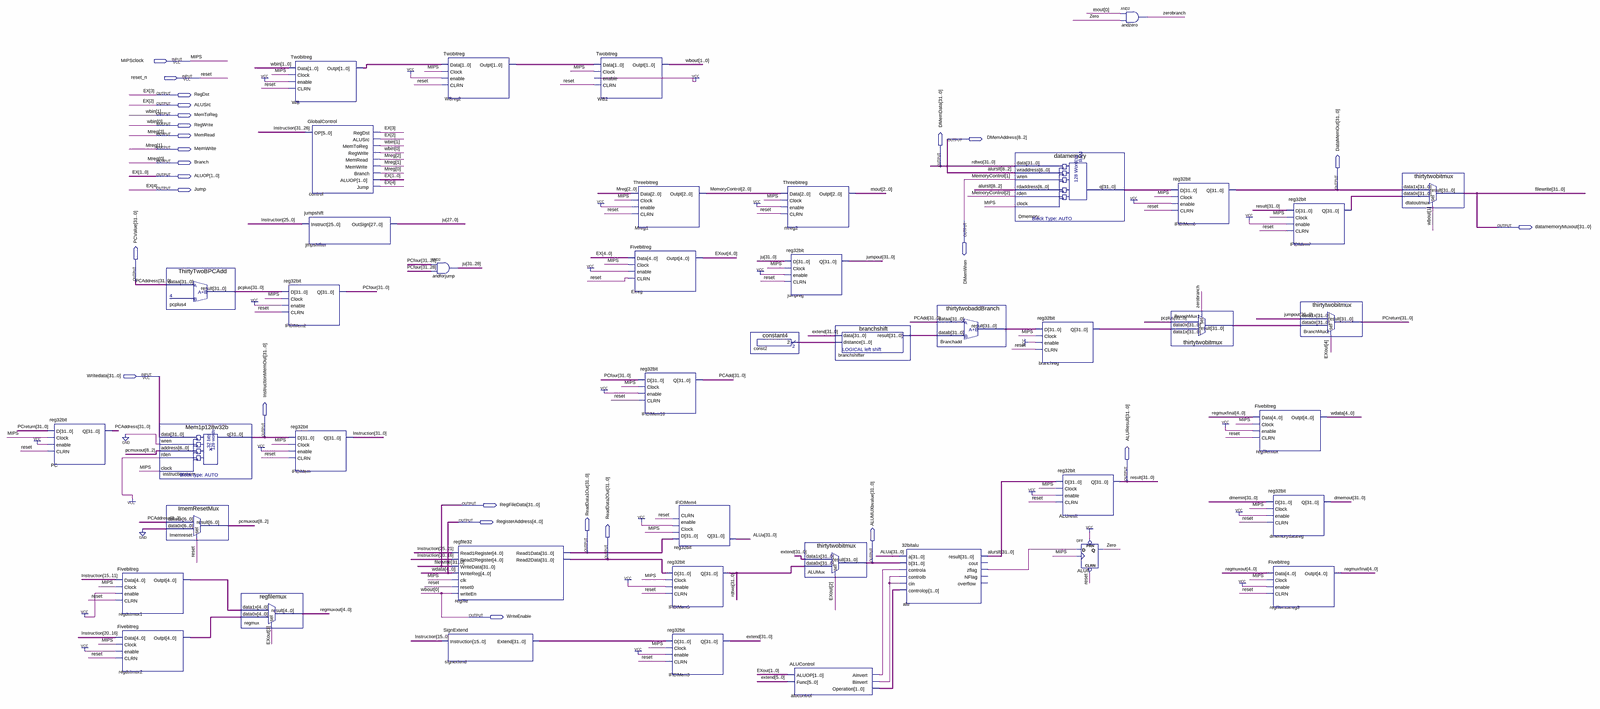
[diagram p0: schematic sheet, whole]
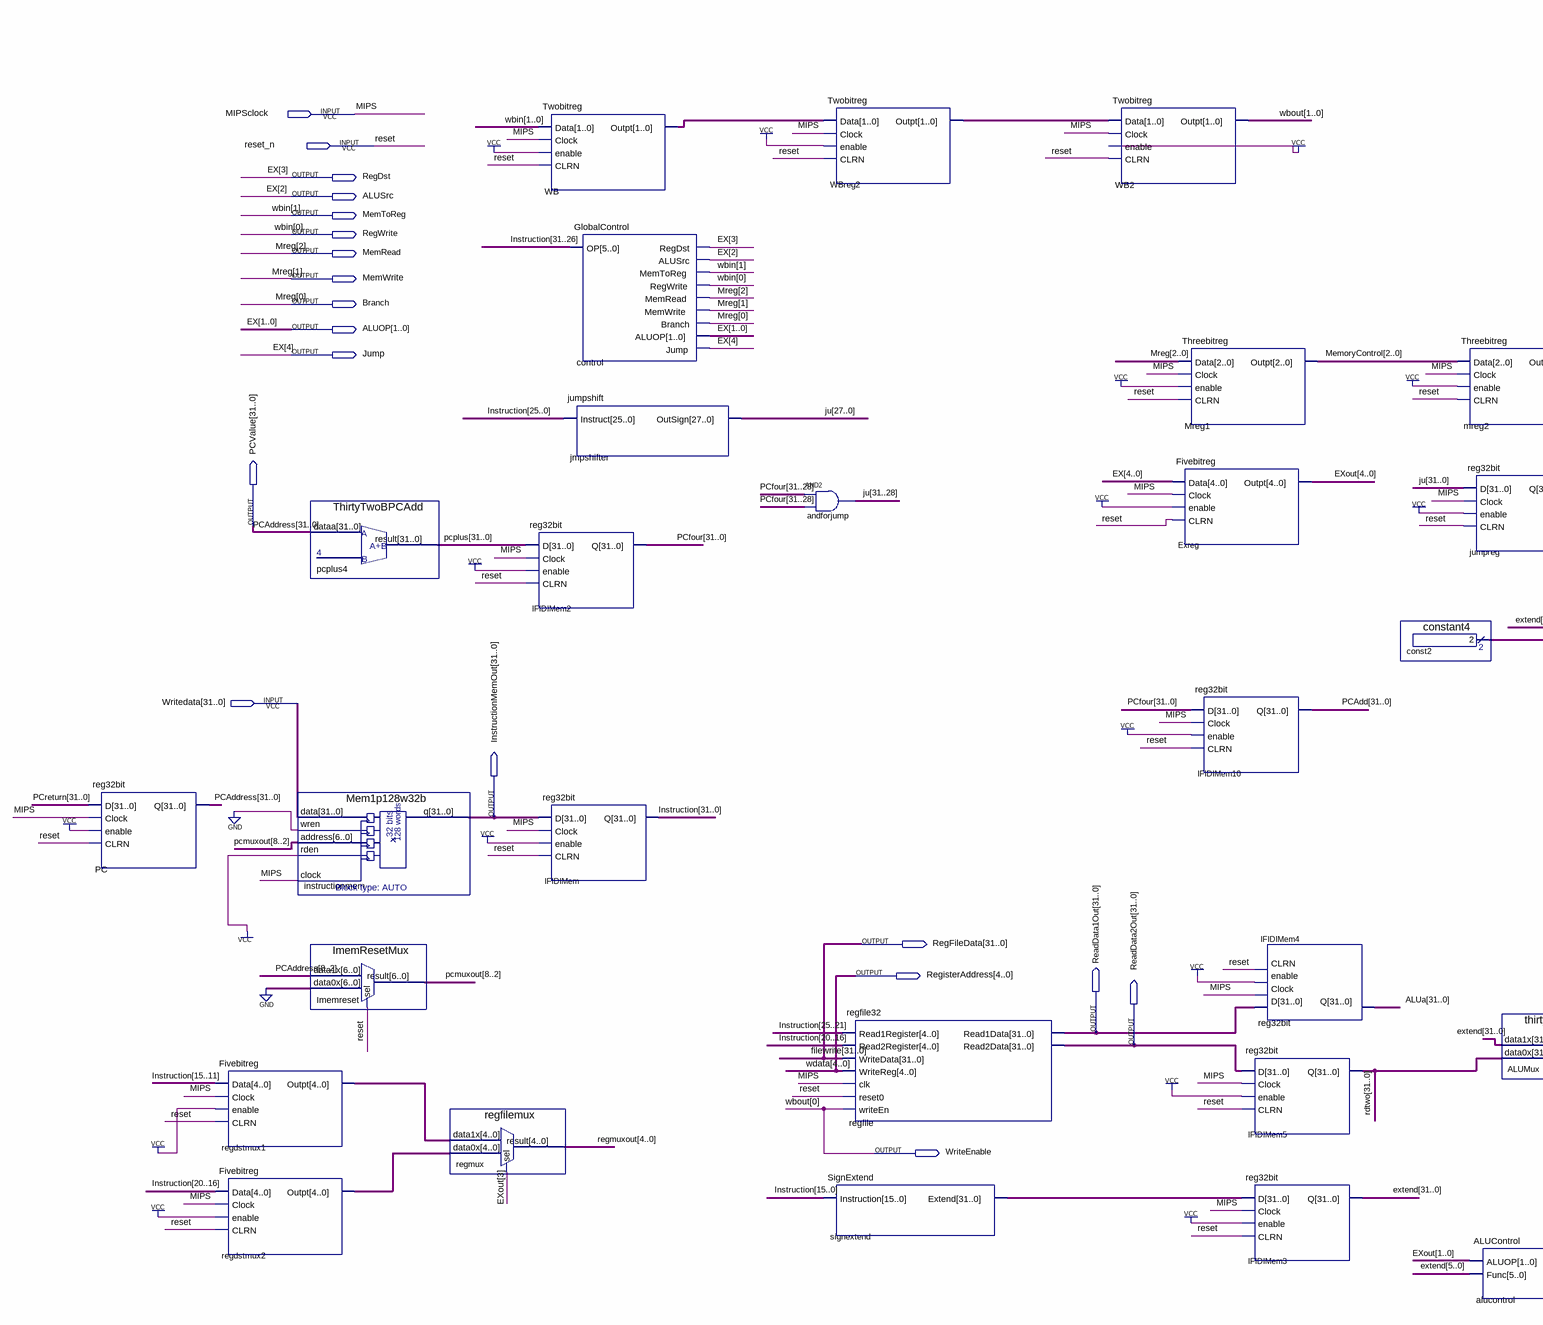
[diagram p1: schematic sheet, left part]
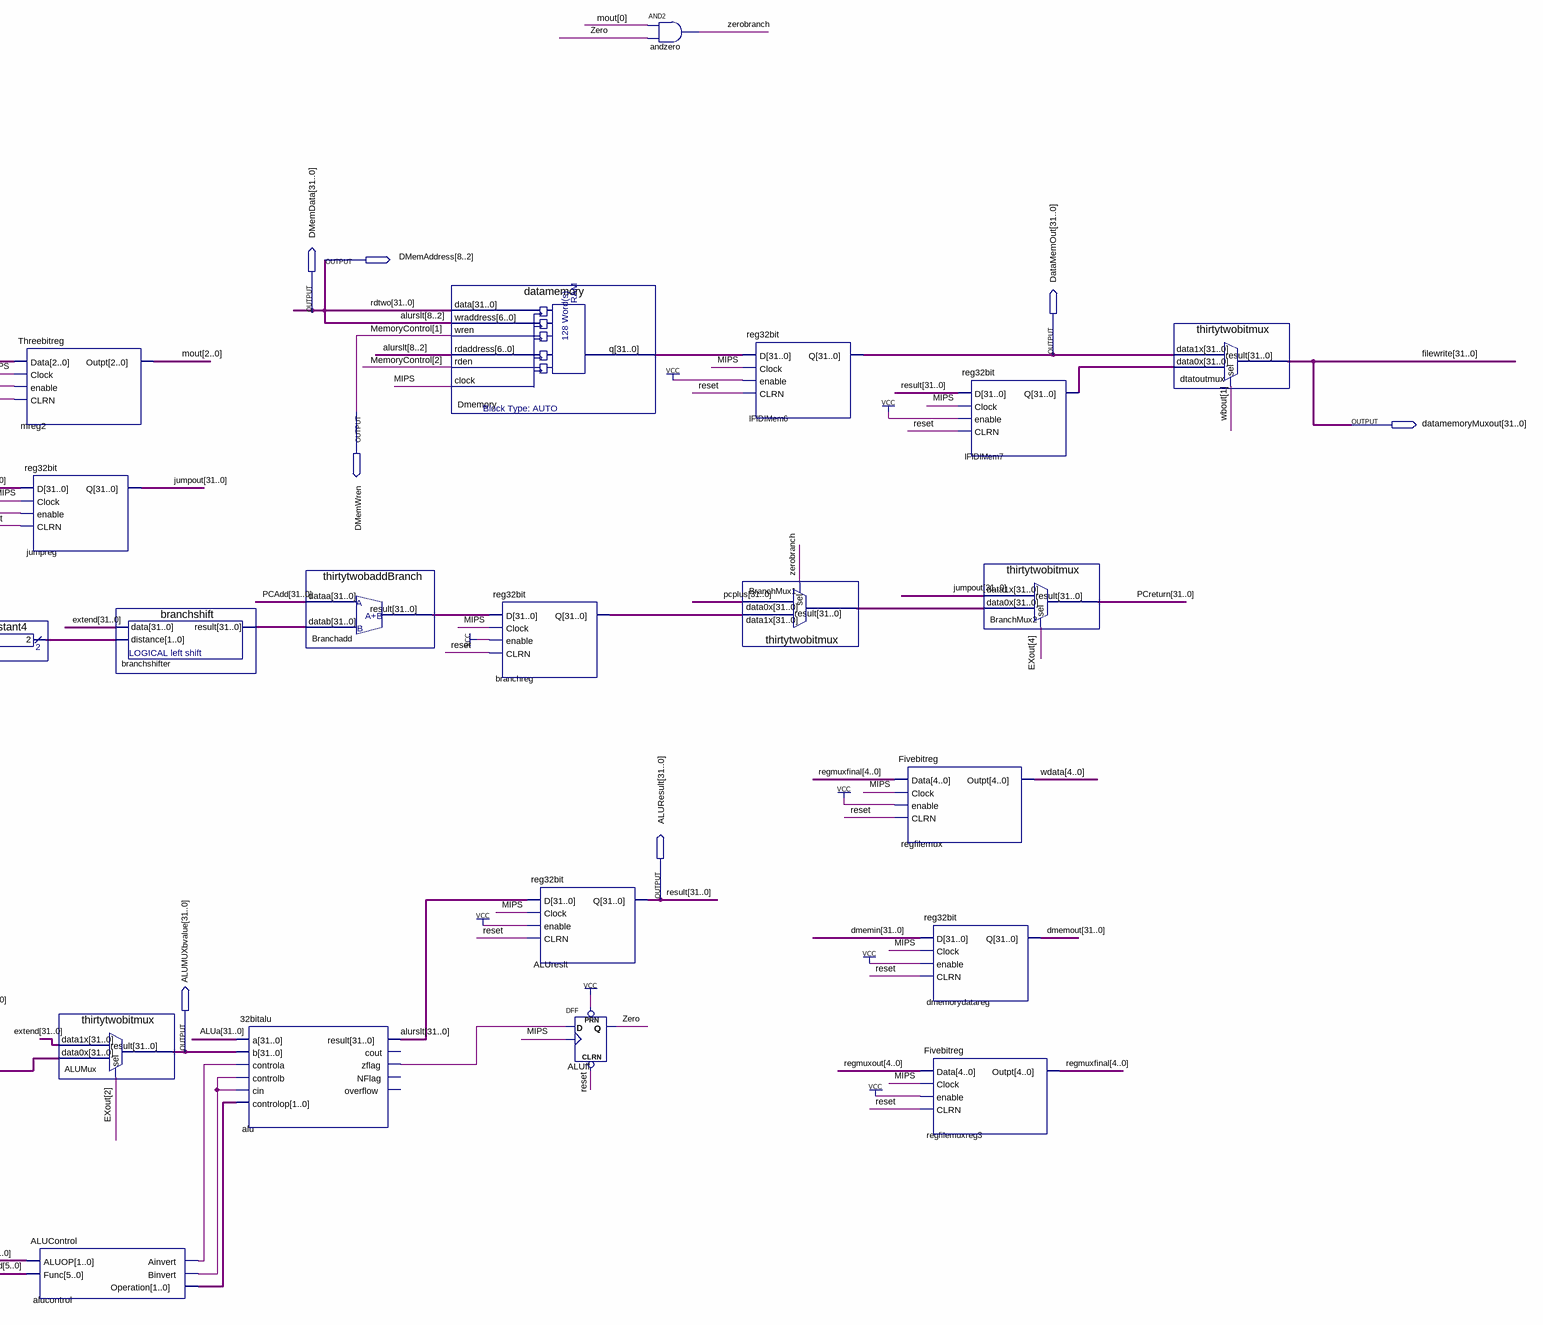
[diagram p2: schematic sheet, right part]
// Quartus schematic mips_pipelined_processor.bdf as structural Verilog: 44 symbols, 26 pins
module mips_pipelined_processor (
  input  MIPSclock,
  input  reset_n,
  input  [31:0] Writedata,
  output RegDst,
  output ALUSrc,
  output MemToReg,
  output RegWrite,
  output MemRead,
  output [8:2] DMemAddress,
  output MemWrite,
  output Branch,
  output [31:0] DMemData,
  output [1:0] ALUOP,
  output Jump,
  output [31:0] DataMemOut,
  output DMemWren,
  output [31:0] datamemoryMuxout,
  output [31:0] PCValue,
  output [31:0] InstructionMemOut,
  output [31:0] ALUResult,
  output [31:0] RegFileData,
  output [4:0] RegisterAddress,
  output [31:0] ReadData1Out,
  output [31:0] ReadData2Out,
  output [31:0] ALUMUXbvalue,
  output WriteEnable
);

  wire alu_zflag, alucontrol_ainvert, alucontrol_binvert, Zero, zerobranch;
  wire [1:0] alucontrol_operation, const2_result, WB_outpt, WBreg2_outpt;
  wire [1:1] wbout;
  wire [2:0] MemoryControl, mout;
  wire [4:0] EXout, regdstmux1_outpt, regdstmux2_outpt, regmuxfinal, regmuxout;
  wire [8:2] pcmuxout;
  wire [31:0] ALUa, alurslt, Branchadd_result, BranchMux1_result, branchreg_q, branchshifter_result, dmemin,
       Dmemory_q, dmemout, extend, IFIDIMem7_q, Instruction, ju, jumpout, PCAdd, PCfour, pcplus, PCreturn,
       signextend_extend;

  reg32bit PC (.D(PCreturn), .Clock(MIPSclock), .enable(1'b1), .CLRN(reset_n), .Q(PCValue));
  Fivebitreg regdstmux1 (
    .Data(Instruction[15:11]), .Clock(MIPSclock), .enable(1'b1), .CLRN(reset_n), .Outpt(regdstmux1_outpt));
  Fivebitreg regdstmux2 (
    .Data(Instruction[20:16]), .Clock(MIPSclock), .enable(1'b1), .CLRN(reset_n), .Outpt(regdstmux2_outpt));
  ThirtyTwoBPCAdd pcplus4 (.dataa(PCValue), .result(pcplus));
  Mem1p128w32b instructionmem (
    .data(Writedata), .wren(1'b0), .address(pcmuxout), .rden(1'b1), .clock(MIPSclock), .q(InstructionMemOut));
  ImemResetMux Imemreset (.data1x(PCValue[8:2]), .data0x({7{1'b0}}), .sel(reset_n), .result(pcmuxout));
  regfilemux regmux (.data1x(regdstmux1_outpt), .data0x(regdstmux2_outpt), .sel(EXout[3]), .result(regmuxout));
  Twobitreg WB (.Data({MemToReg, RegWrite}), .Clock(MIPSclock), .enable(1'b1), .CLRN(reset_n), .Outpt(WB_outpt));
  jumpshift jmpshifter (.Instruct(Instruction[25:0]), .OutSign(ju[27:0]));
  reg32bit IFIDIMem2 (.D(pcplus), .Clock(MIPSclock), .enable(1'b1), .CLRN(reset_n), .Q(PCfour));
  reg32bit IFIDIMem (.D(InstructionMemOut), .Clock(MIPSclock), .enable(1'b1), .CLRN(reset_n), .Q(Instruction));
  GlobalControl control (
    .OP(Instruction[31:26]), .RegDst(RegDst), .ALUSrc(ALUSrc), .MemToReg(MemToReg), .RegWrite(RegWrite),
    .MemRead(MemRead), .MemWrite(MemWrite), .Branch(Branch), .ALUOP(ALUOP), .Jump(Jump));
  assign ju[31:28] = PCfour[31:28] & PCfour[31:28];  // AND2 andforjump, 4 bits wide
  Twobitreg WBreg2 (.Data(WB_outpt), .Clock(MIPSclock), .enable(1'b1), .CLRN(reset_n), .Outpt(WBreg2_outpt));
  regfile32 regfile (
    .Read1Register(Instruction[25:21]), .Read2Register(Instruction[20:16]), .WriteData(datamemoryMuxout),
    .WriteReg(RegisterAddress), .clk(MIPSclock), .reset0(reset_n), .writeEn(WriteEnable),
    .Read1Data(ReadData1Out), .Read2Data(ReadData2Out));
  SignExtend signextend (.Instruction(Instruction[15:0]), .Extend(signextend_extend));
  Twobitreg WB2 (
    .Data(WBreg2_outpt), .Clock(MIPSclock), .enable(1'b1), .CLRN(reset_n), .Outpt({wbout[1], WriteEnable}));
  Fivebitreg Exreg (
    .Data({Jump, RegDst, ALUSrc, ALUOP}), .Clock(MIPSclock), .enable(1'b1), .CLRN(reset_n), .Outpt(EXout));
  Threebitreg Mreg1 (
    .Data({MemRead, MemWrite, Branch}), .Clock(MIPSclock), .enable(1'b1), .CLRN(reset_n),
    .Outpt({MemoryControl[2], DMemWren, MemoryControl[0]}));
  reg32bit IFIDIMem10 (.D(PCfour), .Clock(MIPSclock), .enable(1'b1), .CLRN(reset_n), .Q(PCAdd));
  reg32bit IFIDIMem4 (.D(ReadData1Out), .Clock(MIPSclock), .enable(1'b1), .CLRN(reset_n), .Q(ALUa));
  reg32bit IFIDIMem5 (.D(ReadData2Out), .Clock(MIPSclock), .enable(1'b1), .CLRN(reset_n), .Q(DMemData));
  reg32bit IFIDIMem3 (.D(signextend_extend), .Clock(MIPSclock), .enable(1'b1), .CLRN(reset_n), .Q(extend));
  constant4 const2 (.result(const2_result));
  Threebitreg mreg2 (
    .Data({MemoryControl[2], DMemWren, MemoryControl[0]}), .Clock(MIPSclock), .enable(1'b1), .CLRN(reset_n),
    .Outpt(mout));
  reg32bit jumpreg (.D(ju), .Clock(MIPSclock), .enable(1'b1), .CLRN(reset_n), .Q(jumpout));
  ALUControl alucontrol (
    .ALUOP(EXout[1:0]), .Func(extend[5:0]), .Ainvert(alucontrol_ainvert), .Binvert(alucontrol_binvert),
    .Operation(alucontrol_operation));
  thirtytwobitmux ALUMux (.data1x(extend), .data0x(DMemData), .sel(EXout[2]), .result(ALUMUXbvalue));
  branchshift branchshifter (.data(extend), .distance(const2_result), .result(branchshifter_result));
  \32bitalu  alu (
    .a(ALUa), .b(ALUMUXbvalue), .controla(alucontrol_ainvert), .controlb(alucontrol_binvert),
    .cin(alucontrol_binvert), .controlop(alucontrol_operation),
    .result({alurslt[31:9], DMemAddress, alurslt[1:0]}), .zflag(alu_zflag));  // open: cout, NFlag, overflow
  thirtytwobaddBranch Branchadd (.dataa(PCAdd), .datab(branchshifter_result), .result(Branchadd_result));
  datamemory Dmemory (
    .data(DMemData), .wraddress(DMemAddress), .wren(DMemWren), .rdaddress(DMemAddress),
    .rden(MemoryControl[2]), .clock(MIPSclock), .q(Dmemory_q));
  reg32bit branchreg (.D(Branchadd_result), .Clock(MIPSclock), .enable(1'b1), .CLRN(reset_n), .Q(branchreg_q));
  reg32bit ALUreslt (
    .D({alurslt[31:9], DMemAddress, alurslt[1:0]}), .Clock(MIPSclock), .enable(1'b1), .CLRN(reset_n),
    .Q(ALUResult));
  DFF ALUff (.CLRN(reset_n), .CLK(MIPSclock), .D(alu_zflag), .PRN(1'b1), .Q(Zero));
  and andzero (zerobranch, mout[0], Zero);
  reg32bit IFIDIMem6 (.D(Dmemory_q), .Clock(MIPSclock), .enable(1'b1), .CLRN(reset_n), .Q(DataMemOut));
  thirtytwobitmux BranchMux1 (.data1x(branchreg_q), .data0x(pcplus), .sel(zerobranch), .result(BranchMux1_result));
  Fivebitreg regfilemux (.Data(regmuxfinal), .Clock(MIPSclock), .enable(1'b1), .CLRN(reset_n), .Outpt(RegisterAddress));
  reg32bit dmemorydatareg (.D(dmemin), .Clock(MIPSclock), .enable(1'b1), .CLRN(reset_n), .Q(dmemout));
  Fivebitreg regfilemuxreg3 (.Data(regmuxout), .Clock(MIPSclock), .enable(1'b1), .CLRN(reset_n), .Outpt(regmuxfinal));
  reg32bit IFIDIMem7 (.D(ALUResult), .Clock(MIPSclock), .enable(1'b1), .CLRN(reset_n), .Q(IFIDIMem7_q));
  thirtytwobitmux BranchMux2 (.data1x(jumpout), .data0x(BranchMux1_result), .sel(EXout[4]), .result(PCreturn));
  thirtytwobitmux dtatoutmux (.data1x(DataMemOut), .data0x(IFIDIMem7_q), .sel(wbout[1]), .result(datamemoryMuxout));

  assign RegFileData = datamemoryMuxout;

  // Other names for the same wires on the sheet: result[31:0] = ALUResult; filewrite[31:0] = datamemoryMuxout;
  //   alurslt[8:2] = DMemAddress; rdtwo[31:0] = DMemData; MemoryControl[1] = DMemWren;
  //   EX[4:0] = {Jump, RegDst, ALUSrc, ALUOP}; MIPS = MIPSclock; Mreg[2:0] = {MemRead, MemWrite, Branch};
  //   PCAddress[31:0] = PCValue; reset = reset_n; wbin[1:0] = {MemToReg, RegWrite}; wbout[0] = WriteEnable;
  //   wdata[4:0] = RegisterAddress
endmodule
